# Altium schematic sheet GSM.SchDoc: Sheet
size 420 x 297 mm; DocumentNumber: 1; SheetNumber: 1; SheetTotal: 8
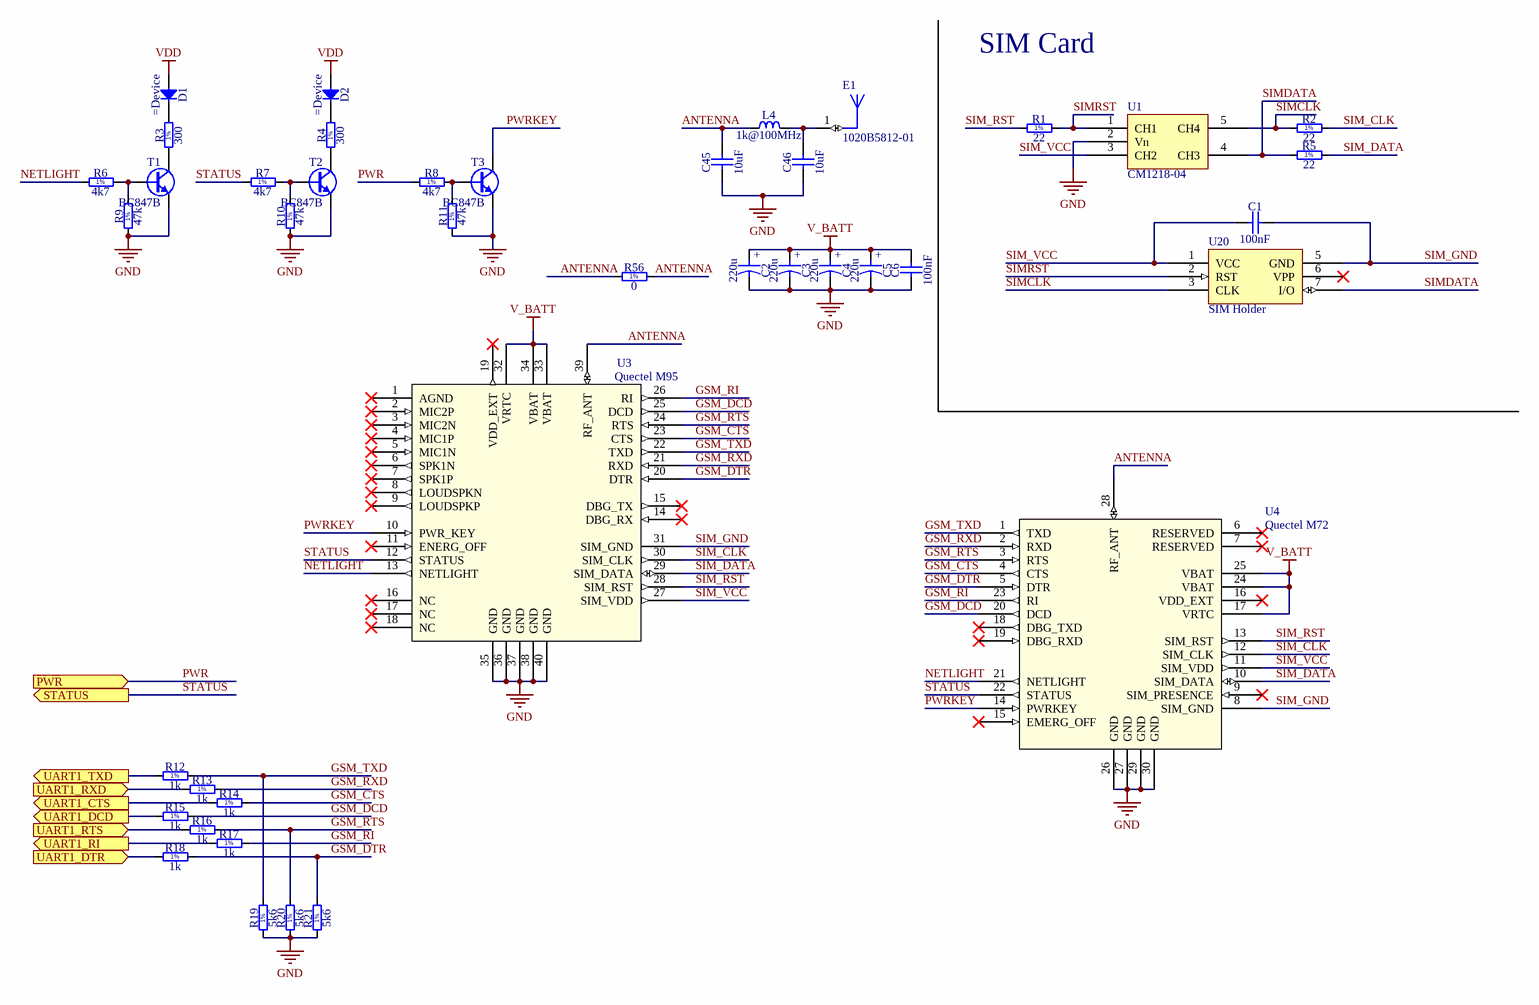
[diagram p0: GSM.SchDoc]

## Parts
C1  100nF  [CAPC1608X87N]
C2  220u  [CAPMP7343X310N]
C3  220u  [CAPMP7343X310N]
C4  220u  [CAPMP7343X310N]
C5  220u  [CAPMP7343X310N]
C6  100nF  [CAPC1608X87N]
C45  10uF  [CAPC1608X87N]
C46  10uF  [CAPC1608X87N]
D1  (no value)  [LED_DIODE_0603]
D2  (no value)  [LED_DIODE_0603]
E1  1020B5812-01  [ANT27.3X7.9]
L4  1k@100MHz  [INDC1608X100N]
R1  22  [RESC1608X55N]
R2  22  [RESC1608X55N]
R3  300  [RESC1608X55N]
R4  300  [RESC1608X55N]
R5  22  [RESC1608X55N]
R6  4k7  [RESC1608X55N]
R7  4k7  [RESC1608X55N]
R8  4k7  [RESC1608X55N]
R9  47k  [RESC1608X55N]
R10  47k  [RESC1608X55N]
R11  47k  [RESC1608X55N]
R12  1k  [RESC1608X55N]
R13  1k  [RESC1608X55N]
R14  1k  [RESC1608X55N]
R15  1k  [RESC1608X55N]
R16  1k  [RESC1608X55N]
R17  1k  [RESC1608X55N]
R18  1k  [RESC1608X55N]
R19  5k6  [RESC1608X55N]
R20  5k6  [RESC1608X55N]
R21  5k6  [RESC1608X55N]
R56  0  [RESC1608X55N]
T1  BC847B  [SOT95P230X110-3N]
T2  BC847B  [SOT95P230X110-3N]
T3  BC847B  [SOT95P230X110-3N]
U1  CM1218-04  [ESD PROTECTOR]
U3  Quectel M95  [QUECTEL M95]
U4  Quectel M72  [Quectel M72 GSM Module]
U20  SIM Holder  [CARD-SIMEE8C15]

## Ports
PWR (in), STATUS (out), UART1_CTS (out), UART1_DCD (out), UART1_DTR (in), UART1_RI (out), UART1_RTS (in), UART1_RXD (in), UART1_TXD (out)

## Nets
GND: C2.2 C3.2 C4.2 C5.2 C6.1 C45.1 C46.1 R9.1 R10.1 R11.1 R19.1 R20.1 R21.1 T1.2(E) T2.2(E) T3.2(E) U1.2(Vn) U3.35(GND) U3.36(GND) U3.37(GND) U3.38(GND) U3.40(GND) U4.26(GND) U4.27(GND) U4.29(GND) U4.30(GND)
V_BATT: C2.1 C3.1 C4.1 C5.1 C6.2 U3.32(VRTC) U3.33(VBAT) U3.34(VBAT) U4.17(VRTC) U4.24(VBAT) U4.25(VBAT)
VDD: D1.2(A) D2.2(A)
ANTENNA: C45.2 L4.1 R56.1 R56.2 U3.39(RF_ANT) U4.28(RF_ANT)
GSM_CTS: R14.2 U3.23(CTS) U4.4(CTS)
GSM_DCD: R15.2 U3.25(DCD) U4.20(DCD)
GSM_DTR: R18.2 R21.2 U3.20(DTR) U4.5(DTR)
GSM_RI: R17.2 U3.26(RI) U4.23(RI)
GSM_RTS: R16.2 R20.2 U3.24(RTS) U4.3(RTS)
GSM_RXD: R13.2 U3.21(RXD) U4.2(RXD)
GSM_TXD: R12.2 R19.2 U3.22(TXD) U4.1(TXD)
NETLIGHT: R6.1 U3.13(NETLIGHT) U4.21(NETLIGHT)
PWR: R8.1 ; port PWR
PWRKEY: T3.3(C) U3.10(PWR_KEY) U4.14(PWRKEY)
SIM_CLK: R2.2 U3.30(SIM_CLK) U4.12(SIM_CLK)
SIM_DATA: R5.2 U3.29(SIM_DATA) U4.10(SIM_DATA)
SIM_GND: C1.2 U3.31(SIM_GND) U4.8(SIM_GND) U20.5(GND)
SIM_RST: R1.1 U3.28(SIM_RST) U4.13(SIM_RST)
SIM_VCC: C1.1 U1.3(CH2) U3.27(SIM_VDD) U4.11(SIM_VDD) U20.1(VCC)
SIMCLK: R2.1 U1.5(CH4) U20.3(CLK)
SIMDATA: R5.1 U1.4(CH3) U20.7(I/O)
SIMRST: R1.2 U1.1(CH1) U20.2(RST)
STATUS: R7.1 U3.12(STATUS) U4.22(STATUS) ; port STATUS
UART1_CTS: R14.1 ; port UART1_CTS
UART1_DCD: R15.1 ; port UART1_DCD
UART1_DTR: R18.1 ; port UART1_DTR
UART1_RI: R17.1 ; port UART1_RI
UART1_RTS: R16.1 ; port UART1_RTS
UART1_RXD: R13.1 ; port UART1_RXD
UART1_TXD: R12.1 ; port UART1_TXD
NetC46_2: C46.2 E1.1(FEED) L4.2
NetD1_1: D1.1(C) R3.2
NetD2_1: D2.1(C) R4.2
NetR3_1: R3.1 T1.3(C)
NetR4_1: R4.1 T2.3(C)
NetR6_2: R6.2 R9.2 T1.1(B)
NetR7_2: R7.2 R10.2 T2.1(B)
NetR8_2: R8.2 R11.2 T3.1(B)

Not connected (* = marked no-connect by the designer): U3 1(AGND)* 2(MIC2P)* 3(MIC2N)* 4(MIC1P)* 5(MIC1N)* 6(SPK1N)* 7(SPK1P)* 8(LOUDSPKN)* 9(LOUDSPKP)* 11(ENERG_OFF)* 14(DBG_RX)* 15(DBG_TX)* 16(NC)* 17(NC)* 18(NC)* 19(VDD_EXT)*; U4 6(RESERVED)* 7(RESERVED)* 9(SIM_PRESENCE)* 15(EMERG_OFF)* 16(VDD_EXT)* 18(DBG_TXD)* 19(DBG_RXD)*; U20 6(VPP)*

## Notes on the sheet
- SIM Card
- Project/Equipment
- Document
- Sensorbox
- Designer
- Drawn by
- Check.by
- Copyright Creotech Instruments SA 2014.
  This documentation describes Open Hardware and is licensed under the CERN OHL v.1.1. You may redistribute and modify this documentation under the terms of the CERN OHL v.1.1. (http://ohwr.org/CERNOHL). This documentation is distributed WITHOUT ANY EXPRESS OR IMPLIED WARRANTY, INCLUDING OF MERCHANTABILITY, SATISFACTORY QUALITY AND FITNESS FOR A PARTICULAR PURPOSE. Please see the CERN OHL v.1.1 for applicable conditions.
- CTI
- Creotech Instruments S.A.
- File
- Last Mod.
- Print Date
- Sheet
- Size
- A3
- of
- Rev
- (in symbol Capacitor - polarized) +
- (in symbol R0603_0R_JUMPER) 1%
- (in symbol R0603_1K_1%_0.1W_100PPM) 1%
- (in symbol R0603_4K7_1%_0.1W_100PPM) 1%
- (in symbol R0603_5K6_1%_0.1W_100PPM) 1%
- (in symbol R0603_22R_1%_0.1W_100PPM) 1%
- (in symbol R0603_47K_1%_0.1W_100PPM) 1%
- (in symbol R0603_300R_1%_0.1W_100PPM) 1%

## Library data of the parts
C1 C6 = CC0603_100NF_50V_10%_X7R: Non-polarised capacitor; Part Description: SMD Multilayer Chip Ceramic Capacitor; Manufacturer: GENERIC; Manufacturer1 Part Number: 223858615649; Voltage: 50V; TC: X7R; Tolerance: ±10%; Table: Capacitors SMD; Part Number: CC0603_100NF_50V_10%_X7R; Component Kind: Standard; Component Type: Standard; Pin Count: 2; Value: 100nF; Status: Preferred; Manufacturer Part Number: CC0603_100NF_50V_10%_X7R; Case: 0603; Mounted: Yes; Socket: No; SMD: Yes; Manufacturer1 Example: PHYCOMP; Manufacturer1 ComponentHeight: 0.87mm; HelpURL: \\cern.ch\dfs\Applications\Altium\Datasheets\CC0603_X7R_PHYCOMP.pdf; Author: CERN DEM JLC; CreateDate: 2007-12-03; LatestRevisionDate: 2007-12-03
C2-C5 = Capacitor - polarized: KEMET T530D
C45 C46 = CC0603_10UF_6.3V_20%_X5R: Non-polarised capacitor; Part Description: SMD Multilayer Chip Ceramic Capacitor; Manufacturer: GENERIC; Manufacturer1 Part Number: C0603C106M9PAC; Voltage: 6.3V; TC: X5R; Tolerance: ±20%; Table: Capacitors SMD; Part Number: CC0603_10UF_6.3V_20%_X5R; Component Kind: Standard; Component Type: Standard; Pin Count: 2; Value: 10uF; Status: Preferred; Manufacturer Part Number: CC0603_10uF_6.3V_20%_X5R; Case: 0603; Mounted: Yes; Socket: No; SMD: Yes; Manufacturer1 Example: KEMET; Manufacturer1 ComponentHeight: 0.95mm; HelpURL: \\cern.ch\dfs\Applications\Altium\Datasheets\CC0603_X5R_KEMET.pdf; Author: CERN DEM JLC; CreateDate: 2007-12-03; LatestRevisionDate: 2007-12-03
D1 D2 = Diode
E1 = 1020B5812-01: Flavus GSM Snap-In Antenna, 800/900/1800/1900 MHz, 0.8mm PCB Thickness; PCB_Layout: Complies with manufacturer's recommendation.; Published: 30-May-2008; DatasheetVersion: AE030090-C; PackageVersion: Feb-2007; PackageReference: ANT27.3X7.9; Publisher: Altium Limited; PackageDescription: Snap-In Antenna, Plastic; Body 27.3 x 7.9 mm (LxW); ComponentLink1Description: Manufacturer Link; ComponentLink1URL: http://www.antenova.com/; ComponentLink2Description: Datasheet; ComponentLink2URL: http://www.antenova.com/?id=855&pv=1&lang=1
L4 = IND0603_WURTH_74279266: Inductor; Part Description: SMD EMI Suppression Chip Bead Ferrite (WE-CBF Serie); Manufacturer: WURTH ELEKTRONIK; Power: 200mA; Resistance: 0.6R; Tolerance: ±25%; Table: Inductors SMD; Part Number: IND0603_WURTH_74279266; Component Kind: Standard; Component Type: Standard; Pin Count: 2; Value: 1k@100MHz; Status: None; Manufacturer Part Number: 74279266; Case: 0603; Mounted: Yes; Socket: No; SMD: Yes; ComponentHeight: 1mm; HelpURL: \\cern.ch\dfs\Applications\Altium\Datasheets\IND0603_WURTH_74279266.pdf; Author: CERN DEM JLC; CreateDate: 2011-03-08; LatestRevisionDate: 2011-03-08
R1 R2 R5 = R0603_22R_1%_0.1W_100PPM: Resistor - 1%; Part Description: General Purpose Thick Film Chip Resistor; Manufacturer: GENERIC; Manufacturer1 Part Number: NRC06F22R0TRF; Power: 0.1W; TC: ±100ppm/°C; Table: Resistors SMD; Part Number: R0603_22R_1%_0.1W_100PPM; Component Kind: Standard; Component Type: Standard; Pin Count: 2; Value: 22; Status: Preferred; Tolerance: ±1%; Manufacturer Part Number: R0603_22R_1%_0.1W_100PPM; Case: 0603; Mounted: Yes; Socket: No; SMD: Yes; Manufacturer1 Example: NIC COMPONENT; Manufacturer1 ComponentHeight: 0.55mm; HelpURL: \\cern.ch\dfs\Applications\Altium\Datasheets\R0603_NIC_NRC.pdf; Author: CERN DEM JLC; CreateDate: 2007-12-03; LatestRevisionDate: 2008-03-13
R3 R4 = R0603_300R_1%_0.1W_100PPM: Resistor - 1%; Part Description: General Purpose Thick Film Chip Resistor; Manufacturer: GENERIC; Manufacturer1 Part Number: NRC06F3000TRF; Power: 0.1W; TC: ±100ppm/°C; Table: Resistors SMD; Part Number: R0603_300R_1%_0.1W_100PPM; Component Kind: Standard; Component Type: Standard; Pin Count: 2; Value: 300; Status: Preferred; Tolerance: ±1%; Manufacturer Part Number: R0603_300R_1%_0.1W_100PPM; Case: 0603; Mounted: Yes; Socket: No; SMD: Yes; Manufacturer1 Example: NIC COMPONENT; Manufacturer1 ComponentHeight: 0.55mm; HelpURL: \\cern.ch\dfs\Applications\Altium\Datasheets\R0603_NIC_NRC.pdf; Author: CERN DEM JLC; CreateDate: 2007-12-03; LatestRevisionDate: 2008-03-13
R6-R8 = R0603_4K7_1%_0.1W_100PPM: Resistor - 1%; Part Description: General Purpose Thick Film Chip Resistor; Manufacturer: GENERIC; Manufacturer1 Part Number: NRC06F4701TRF; Power: 0.1W; TC: ±100ppm/°C; Table: Resistors SMD; Part Number: R0603_4K7_1%_0.1W_100PPM; Component Kind: Standard; Component Type: Standard; Pin Count: 2; Value: 4k7; Status: Preferred; Tolerance: ±1%; Manufacturer Part Number: R0603_4K7_1%_0.1W_100PPM; Case: 0603; Mounted: Yes; Socket: No; SMD: Yes; Manufacturer1 Example: NIC COMPONENT; Manufacturer1 ComponentHeight: 0.55mm; HelpURL: \\cern.ch\dfs\Applications\Altium\Datasheets\R0603_NIC_NRC.pdf; Author: CERN DEM JLC; CreateDate: 2007-12-03; LatestRevisionDate: 2008-03-13
R9-R11 = R0603_47K_1%_0.1W_100PPM: Resistor - 1%; Part Description: General Purpose Thick Film Chip Resistor; Manufacturer: GENERIC; Manufacturer1 Part Number: NRC06F4702TRF; Power: 0.1W; TC: ±100ppm/°C; Table: Resistors SMD; Part Number: R0603_47K_1%_0.1W_100PPM; Component Kind: Standard; Component Type: Standard; Pin Count: 2; Value: 47k; Status: Preferred; Tolerance: ±1%; Manufacturer Part Number: R0603_47K_1%_0.1W_100PPM; Case: 0603; Mounted: Yes; Socket: No; SMD: Yes; Manufacturer1 Example: NIC COMPONENT; Manufacturer1 ComponentHeight: 0.55mm; HelpURL: \\cern.ch\dfs\Applications\Altium\Datasheets\R0603_NIC_NRC.pdf; Author: CERN DEM JLC; CreateDate: 2007-12-03; LatestRevisionDate: 2008-03-13
R12-R18 = R0603_1K_1%_0.1W_100PPM: Resistor - 1%; Part Description: General Purpose Thick Film Chip Resistor; Manufacturer: GENERIC; Manufacturer1 Part Number: NRC06F1001TRF; Power: 0.1W; TC: ±100ppm/°C; Table: Resistors SMD; Part Number: R0603_1K_1%_0.1W_100PPM; Component Kind: Standard; Component Type: Standard; Pin Count: 2; Value: 1k; Status: Preferred; Tolerance: ±1%; Manufacturer Part Number: R0603_1K_1%_0.1W_100PPM; Case: 0603; Mounted: Yes; Socket: No; SMD: Yes; Manufacturer1 Example: NIC COMPONENT; Manufacturer1 ComponentHeight: 0.55mm; HelpURL: \\cern.ch\dfs\Applications\Altium\Datasheets\R0603_NIC_NRC.pdf; Author: CERN DEM JLC; CreateDate: 2007-12-03; LatestRevisionDate: 2008-03-13
R19-R21 = R0603_5K6_1%_0.1W_100PPM: Resistor - 1%; Part Description: General Purpose Thick Film Chip Resistor; Manufacturer: GENERIC; Manufacturer1 Part Number: NRC06F5601TRF; Power: 0.1W; TC: ±100ppm/°C; Table: Resistors SMD; Part Number: R0603_5K6_1%_0.1W_100PPM; Component Kind: Standard; Component Type: Standard; Pin Count: 2; Value: 5k6; Status: Preferred; Tolerance: ±1%; Manufacturer Part Number: R0603_5K6_1%_0.1W_100PPM; Case: 0603; Mounted: Yes; Socket: No; SMD: Yes; Manufacturer1 Example: NIC COMPONENT; Manufacturer1 ComponentHeight: 0.55mm; HelpURL: \\cern.ch\dfs\Applications\Altium\Datasheets\R0603_NIC_NRC.pdf; Author: CERN DEM JLC; CreateDate: 2007-12-03; LatestRevisionDate: 2008-03-13
R56 = R0603_0R_JUMPER: Resistor - 1%; Part Description: 1A (0.05R Max DC Resistance) Zero Ohm Jumper; Manufacturer: GENERIC; Manufacturer1 Part Number: NRC06Z0; Table: Resistors SMD; Part Number: R0603_0R_JUMPER; Component Kind: Standard; Component Type: Standard; Pin Count: 2; Value: 0; Status: Preferred; Manufacturer Part Number: R0603_0R_JUMPER; Case: 0603; Mounted: Yes; Socket: No; SMD: Yes; Manufacturer1 Example: NIC COMPONENT; Manufacturer1 ComponentHeight: 0.55mm; HelpURL: \\cern.ch\dfs\Applications\Altium\Datasheets\R0603_NIC_NRC.pdf; Author: CERN DEM JLC; CreateDate: 2007-12-03; LatestRevisionDate: 2008-03-13
T1-T3 = BC847B: NPN Transistor; Part Description: 45V, 100mA NPN general-purpose transistors; Manufacturer: NXP SEMICONDUCTORS; Table: Transistors; Part Number: BC847B; Component Kind: Standard; Component Type: Standard; Device: BC847B; PackageDescription: SOT23, 3 pin, Pitch 0.95mm - 1.3mm W X 2.9mm L X 1.1mm H, IPC Medium Density; Manufacturer Part Number: BC847B; Pin Count: 3; Case: SOT23-3; Mounted: Yes; Socket: No; SMD: Yes; ComponentHeight: 1.1mm; HelpURL: \\cern.ch\dfs\Applications\Altium\Datasheets\BC847B.pdf; Author: CERN DEM JLC; CreateDate: 2011-06-14; LatestRevisionDate: 2011-06-14
U1 = CM1218-04 ESD_Protector SOT23-5 Package: ESD_Protector SOT23-5 Package
U3 = Quectel M95: GSM Module
U4 = Quectel M72: GSM Module
U20 = SIM Holder: 6-pin SIM Holder